# EAGLE board CFT-PB0 (EAGLE 5.11)
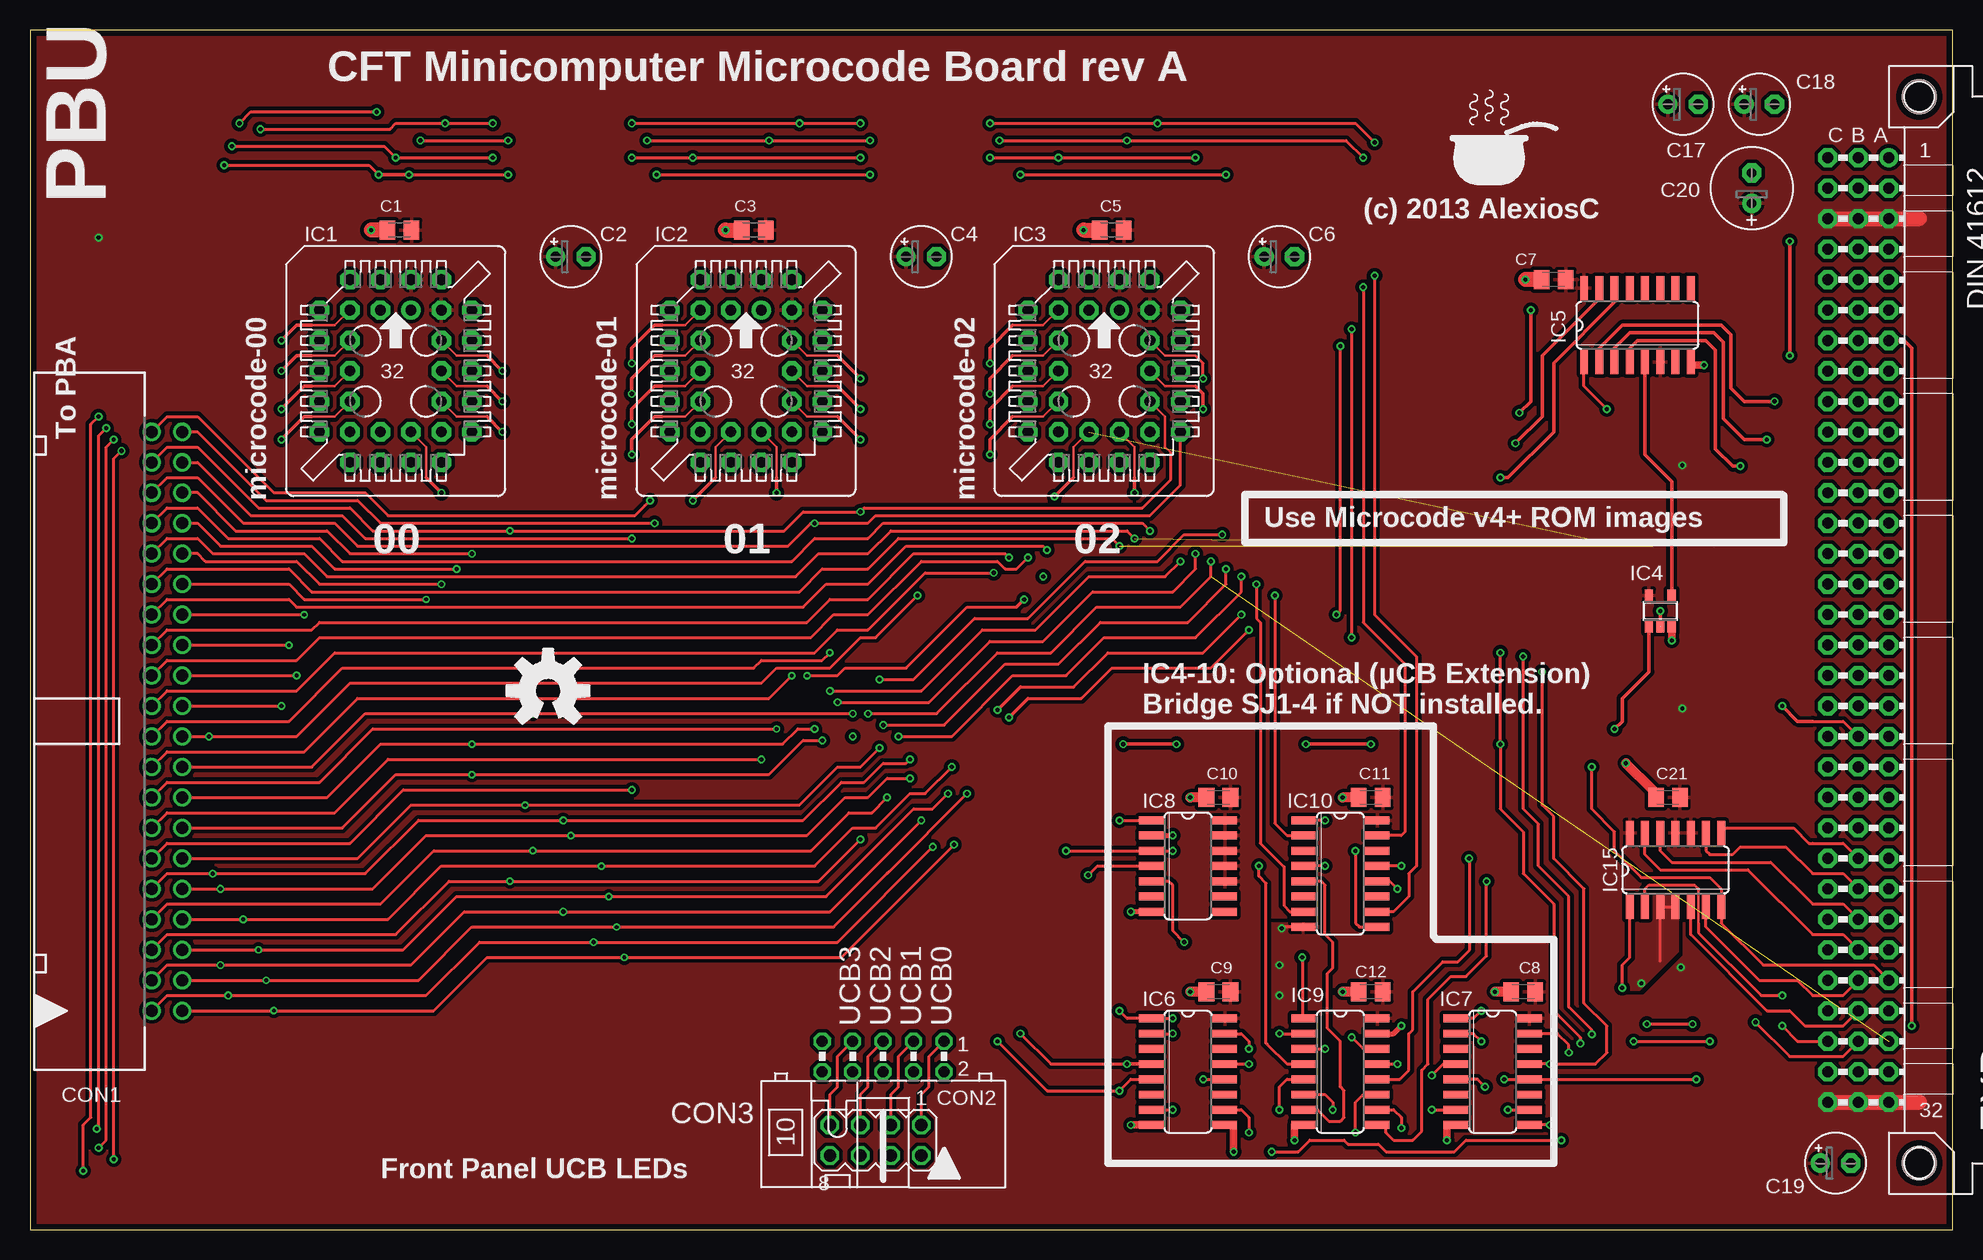
[diagram p4: board, top side]
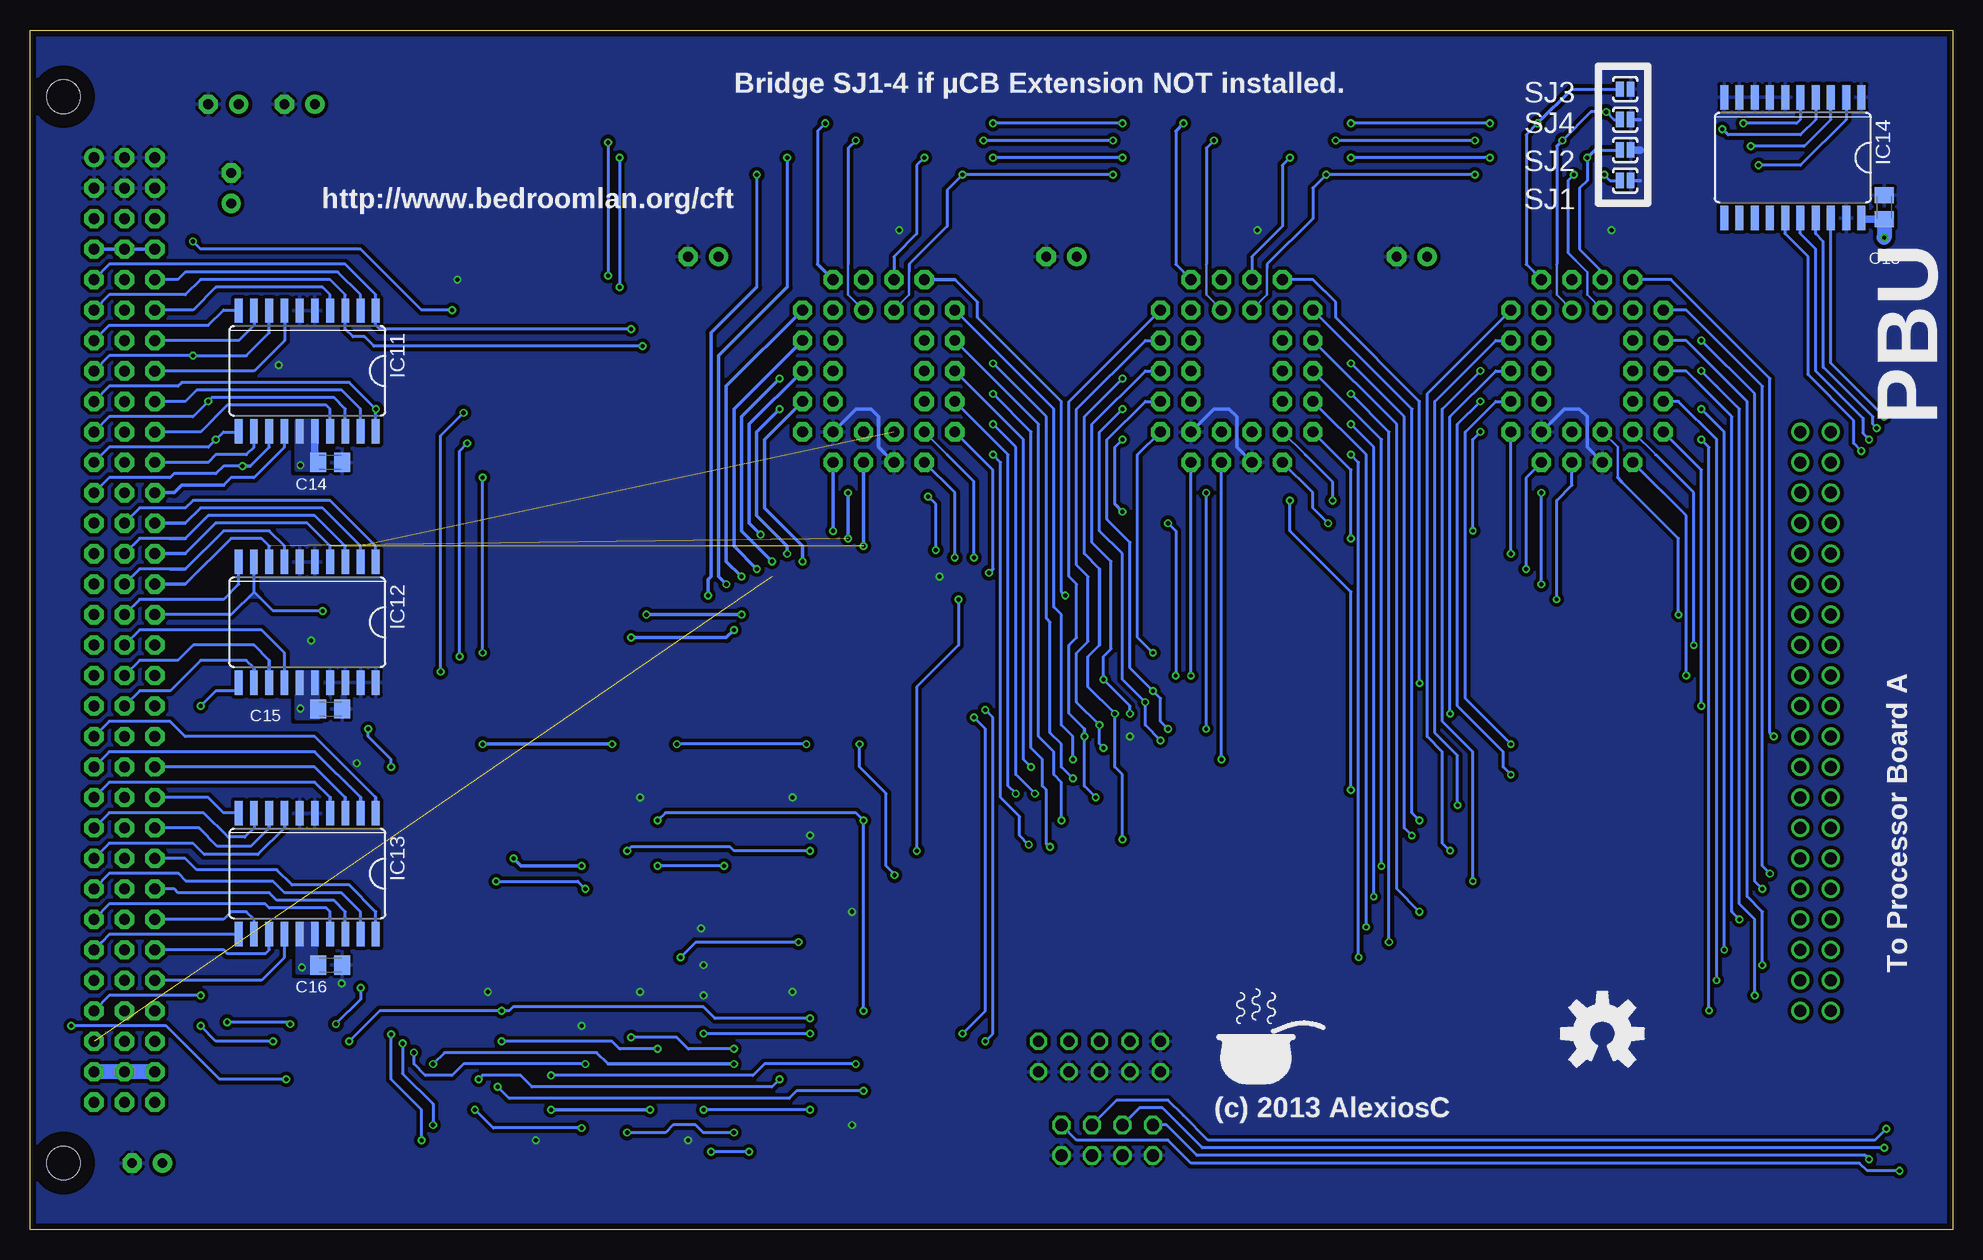
[diagram p5: board, bottom side, seen from below]

Size 160.27 x 100.03 mm. Coordinates in mm from the lower left corner, seen from the top.
Copper layers (1*16): Top 0.035mm / dielectric 1.5mm / Bottom 0.035mm
Design rules "smart-prototyping": minimum track width 7mil, minimum drill 12mil, track to track 7mil, track to pad 7mil, pad to pad 7mil, via to via 7mil, smd to smd 0mil, copper to edge 20mil, drill to drill 10mil, minimum pad ring 10mil, minimum via ring 6mil, stop-mask expansion 2mil, vias tented up to drill 25mil, thermal gap 10mil
Net classes: 0 default: width 0.203 mm, clearance 0.203 mm; 1 low power: width 0.203 mm, clearance 0.254 mm; 2 LED power: width 1.93 mm, clearance 0.254 mm

## Footprints (pad centres in the part's own frame; a part is rotated, then mirrored left to right if it is on the bottom)
C0805K = smd 1.3 x 1.6: 1 -1,0; 2 1,0
E2,5-5 = drill 0.813 pad 1.6 round: + -1.27,0 | drill 0.813 pad 1.6 octagon: - 1.27,0
E2,5-7 = drill 0.813 pad 1.6 round: + -1.27,0 | drill 0.813 pad 1.6 octagon: - 1.27,0
PAK100/2500-5-40 = drill 1 pad 1.422 round: 1 -24.13,-1.27; 2 -24.13,1.27; 3 -21.59,-1.27; 4 -21.59,1.27; 5 -19.05,-1.27; 6 -19.05,1.27; 7 -16.51,-1.27; 8 -16.51,1.27; 9 -13.97,-1.27; 10 -13.97,1.27; 11 -11.43,-1.27; 12 -11.43,1.27; 13 -8.89,-1.27; 14 -8.89,1.27; 15 -6.35,-1.27; 16 -6.35,1.27; 17 -3.81,-1.27; 18 -3.81,1.27; 19 -1.27,-1.27; 20 -1.27,1.27; 21 1.27,-1.27; 22 1.27,1.27; 23 3.81,-1.27; 24 3.81,1.27; 25 6.35,-1.27; 26 6.35,1.27; 27 8.89,-1.27; 28 8.89,1.27; 29 11.43,-1.27; 30 11.43,1.27; 31 13.97,-1.27; 32 13.97,1.27; 33 16.51,-1.27; 34 16.51,1.27; 35 19.05,-1.27; 36 19.05,1.27; 37 21.59,-1.27; 38 21.59,1.27; 39 24.13,-1.27; 40 24.13,1.27
MA04-2 = drill 1.016 octagon: 1 -3.81,-1.27; 2 -3.81,1.27; 3 -1.27,-1.27; 4 -1.27,1.27; 5 1.27,-1.27; 6 1.27,1.27; 7 3.81,-1.27; 8 3.81,1.27
ML10L = drill 0.914 octagon: 1 -5.08,-1.27; 2 -5.08,1.27; 3 -2.54,-1.27; 4 -2.54,1.27; 5 0,-1.27; 6 0,1.27; 7 2.54,-1.27; 8 2.54,1.27; 9 5.08,-1.27; 10 5.08,1.27
VG96K = drill 0.914 pad 1.6 round: A1 154.94,39.37 | drill 0.914 pad 1.6 octagon: A2 154.94,36.83; A3 154.94,34.29; A4 154.94,31.75; A5 154.94,29.21; A6 154.94,26.67; A7 154.94,24.13; A8 154.94,21.59; A9 154.94,19.05; A10 154.94,16.51; A11 154.94,13.97; A12 154.94,11.43; A13 154.94,8.89; A14 154.94,6.35; A15 154.94,3.81; A16 154.94,1.27; A17 154.94,-1.27; A18 154.94,-3.81; A19 154.94,-6.35; A20 154.94,-8.89; A21 154.94,-11.43; A22 154.94,-13.97; A23 154.94,-16.51; A24 154.94,-19.05; A25 154.94,-21.59; A26 154.94,-24.13; A27 154.94,-26.67; A28 154.94,-29.21; A29 154.94,-31.75; A30 154.94,-34.29; A31 154.94,-36.83; A32 154.94,-39.37; B1 152.4,39.37; B2 152.4,36.83; B3 152.4,34.29; B4 152.4,31.75; B5 152.4,29.21; B6 152.4,26.67; B7 152.4,24.13; B8 152.4,21.59; B9 152.4,19.05; B10 152.4,16.51; B11 152.4,13.97; B12 152.4,11.43; B13 152.4,8.89; B14 152.4,6.35; B15 152.4,3.81; B16 152.4,1.27; B17 152.4,-1.27; B18 152.4,-3.81; B19 152.4,-6.35; B20 152.4,-8.89; B21 152.4,-11.43; B22 152.4,-13.97; B23 152.4,-16.51; B24 152.4,-19.05; B25 152.4,-21.59; B26 152.4,-24.13; B27 152.4,-26.67; B28 152.4,-29.21; B29 152.4,-31.75; B30 152.4,-34.29; B31 152.4,-36.83; B32 152.4,-39.37; C1 149.86,39.37; C2 149.86,36.83; C3 149.86,34.29; C4 149.86,31.75; C5 149.86,29.21; C6 149.86,26.67; C7 149.86,24.13; C8 149.86,21.59; C9 149.86,19.05; C10 149.86,16.51; C11 149.86,13.97; C12 149.86,11.43; C13 149.86,8.89; C14 149.86,6.35; C15 149.86,3.81; C16 149.86,1.27; C17 149.86,-1.27; C18 149.86,-3.81; C19 149.86,-6.35; C20 149.86,-8.89; C21 149.86,-11.43; C22 149.86,-13.97; C23 149.86,-16.51; C24 149.86,-19.05; C25 149.86,-21.59; C26 149.86,-24.13; C27 149.86,-26.67; C28 149.86,-29.21; C29 149.86,-31.75; C30 149.86,-34.29; C31 149.86,-36.83; C32 149.86,-39.37 | hole 2.794: 157.48,44.45; 157.48,-44.45
PLCC32 = drill 0.9 pad 1.6 round: 1 1.27,5.08 | drill 0.9 pad 1.6 octagon: 2 -1.27,7.62; 3 -1.27,5.08; 4 -3.81,7.62; 5 -6.35,5.08; 6 -3.81,5.08; 7 -6.35,2.54; 8 -3.81,2.54; 9 -6.35,0; 10 -3.81,0; 11 -6.35,-2.54; 12 -3.81,-2.54; 13 -6.35,-5.08; 14 -3.81,-7.62; 15 -3.81,-5.08; 16 -1.27,-7.62; 17 -1.27,-5.08; 18 1.27,-7.62; 19 1.27,-5.08; 20 3.81,-7.62; 21 6.35,-5.08; 22 3.81,-5.08; 23 6.35,-2.54; 24 3.81,-2.54; 25 6.35,0; 26 3.81,0; 27 6.35,2.54; 28 3.81,2.54; 29 6.35,5.08; 30 3.81,7.62; 31 3.81,5.08; 32 1.27,7.62
SOT23-5 = smd 0.69 x 0.99: 1 -0.95,-1.29; 2 0,-1.29; 3 0.95,-1.29; 4 0.95,1.3; 5 -0.95,1.3
SO16 = smd 0.66 x 2.032: 1 -4.445,-3.073; 2 -3.175,-3.073; 3 -1.905,-3.073; 4 -0.635,-3.073; 5 0.635,-3.073; 6 1.905,-3.073; 7 3.175,-3.073; 8 4.445,-3.073; 9 4.445,3.073; 10 3.175,3.073; 11 1.905,3.073; 12 0.635,3.073; 13 -0.635,3.073; 14 -1.905,3.073; 15 -3.175,3.073; 16 -4.445,3.073
SO14 = smd 0.66 x 2.032: 1 -3.81,-3.073; 2 -2.54,-3.073; 3 -1.27,-3.073; 4 0,-3.073; 5 1.27,-3.073; 6 2.54,-3.073; 7 3.81,-3.073; 8 3.81,3.073; 9 2.54,3.073; 10 1.27,3.073; 11 0,3.073; 12 -1.27,3.073; 13 -2.54,3.073; 14 -3.81,3.073
SO20W = smd 0.66 x 2.032: 1 -5.715,-5.029; 2 -4.445,-5.029; 3 -3.175,-5.029; 4 -1.905,-5.029; 5 -0.635,-5.029; 6 0.635,-5.029; 7 1.905,-5.029; 8 3.175,-5.029; 9 4.445,-5.029; 10 5.715,-5.029; 11 5.715,5.029; 12 4.445,5.029; 13 3.175,5.029; 14 1.905,5.029; 15 0.635,5.029; 16 -0.635,5.029; 17 -1.905,5.029; 18 -3.175,5.029; 19 -4.445,5.029; 20 -5.715,5.029
SJ_2S-NO = smd 0.635 x 1.27: 1 -0.45,0; 2 0.45,0

## Placement (x,y rotation side)
$4_37_$  SIGNATURESILK  [SIGNATURE]  60.96,11.91 0 bottom
$4_39_$  OSHW-LOGOL  [OSHW-LOGO-L]  29.21,16.36 0 bottom
$4_40_$  QRCODE-CFT  [CFT-QRCODE]  -22.86,1.12 0 top  (outside the outline)
C1  0.1uF  [C0805K]  30.8,83.35 180 top
C2  1uF  [E2,5-5]  45.09,81.13 0 top
C3  0.1uF  [C0805K]  60.33,83.35 180 top
C4  1uF  [E2,5-5]  74.3,81.13 0 top
C5  0.1uF  [C0805K]  90.17,83.35 180 top
C6  1uF  [E2,5-5]  104.14,81.13 0 top
C7  0.1uF  [C0805K]  127,79.22 180 top
C8  0.1uF  [C0805K]  124.46,19.85 180 top
C9  0.1uF  [C0805K]  99.06,19.85 180 top
C10  0.1uF  [C0805K]  99.06,36.04 180 top
C11  0.1uF  [C0805K]  111.76,36.04 180 top
C12  0.1uF  [C0805K]  111.76,19.85 180 top
C13  0.1uF  [C0805K]  5.71,85.26 90 bottom
C14  0.1uF  [C0805K]  135.25,63.98 0 bottom
C15  0.1uF  [C0805K]  135.25,43.41 0 bottom
C16  0.1uF  [C0805K]  135.25,22.07 0 bottom
C17  1uF  [E2,5-5]  137.79,93.83 0 top
C18  47uF  [E2,5-5]  144.15,93.83 0 top
C19  47uF  [E2,5-5]  150.5,5.56 0 top
C20  100uF  [E2,5-7]  143.51,86.84 90 top
C21  0.1uF  [C0805K]  136.53,36.04 180 top
CON1  2540-5  [PAK100/2500-5-40]  11.43,42.39 90 top
CON2  [MA04-2]  70.48,7.47 180 top
CON3  [ML10L]  71.12,14.45 180 top
EXP  [VG96K]  0,50.01 0 top
IC1  29F040  [PLCC32]  30.48,71.6 0 top
IC2  29F040  [PLCC32]  59.69,71.6 0 top
IC3  29F040  [PLCC32]  89.53,71.6 0 top
IC4  74AHC1G32DBV  [SOT23-5]  135.89,51.6 0 top
IC5  74HC138D  [SO16]  133.99,75.41 0 top
IC6  74HC175D  [SO16]  96.52,13.18 270 top
IC7  74HC175D  [SO16]  121.92,13.18 270 top
IC8  74HC74D  [SO14]  96.52,30.33 270 top
IC9  74HC157D  [SO16]  109.22,13.18 270 top
IC10  74HC175D  [SO16]  109.22,29.69 270 top
IC11  SN74ACT1073  [SO20W]  137.16,71.6 180 bottom
IC12  SN74ACT1073  [SO20W]  137.16,50.65 180 bottom
IC13  SN74ACT1073  [SO20W]  137.16,29.69 180 bottom
IC14  74HC541DW  [SO20W]  13.34,89.38 180 bottom
IC15  SN74ACT1071D  [SO14]  137.16,30.01 0 top
SJ1  SOLDERJUMPER-OLDNO  [SJ_2S-NO]  27.3,87.48 180 bottom
SJ2  SOLDERJUMPER-OLDNO  [SJ_2S-NO]  27.3,90.02 180 bottom
SJ3  SOLDERJUMPER-OLDNO  [SJ_2S-NO]  27.3,95.1 180 bottom
SJ4  SOLDERJUMPER-OLDNO  [SJ_2S-NO]  27.3,92.56 180 bottom
U$1  SIGNATURESILK  [SIGNATURE]  118.75,86.84 0 top
U$3  OSHW-LOGOL  [OSHW-LOGO-L]  43.18,44.93 0 top
X1  2540-5  [PAK100/2500-5-40]  5.08,-68.73 0 top  (outside the outline)

## Tracks (layer width: path | path; a pad name or v marks a point on that pad's centre or on a via)
!AINDEX  (via drill 0.35)
  Top 0.203: 23.5,72.87 25.4,72.87 IC1.8 | 52.7,72.87 54.61,72.87 IC2.8 | 81.92,72.87 84.45,72.87 IC3.8
  Top 0.254: CON1.2 11.43,19.53 v16.51,19.53 33.02,19.53 37.47,23.98 v46.99,23.98 67.31,23.98 v75.25,31.92
  Top 0.305: v20.95,71.6 22.23,72.87 23.5,72.87 | v50.16,69.7 50.16,70.97 52.07,72.87 52.7,72.87 | v80.01,69.7 80.01,70.97 81.92,72.87
  Bottom 0.254: v50.16,69.7 46.99,66.52 v46.99,23.98 | v16.51,19.53 16.51,25.88 17.78,27.15 17.78,68.43 v20.95,71.6 | v80.01,69.7 76.83,66.52 76.83,40.17 75.88,39.22 75.88,37 75.56,36.68 75.56,32.17 75.25,31.85 v75.25,31.92
!CLI  (via drill 0.3)
  Top 0.254: CON1.18 11.43,39.85 22.86,39.85 27.3,44.3 61.59,44.3 v63.5,46.2
  Bottom 0.254: v63.5,46.2 IC2.20
!CLL  (via drill 0.35)
  Top 0.254: CON1.14 11.43,34.77 25.4,34.77 29.84,39.22 v60.96,39.22
  Bottom 0.254: v60.96,39.22 IC2.18
!CPL  (via drill 0.35)
  Top 0.203: 57.15,62.71 57.15,65.25 IC2.17
  Top 0.254: CON1.12 11.43,32.23 26.67,32.23 31.11,36.68 v50.16,36.68
  Top 0.305: v55.24,60.81 57.15,62.71
  Bottom 0.254: v55.24,60.81 55.24,58.27 50.16,53.19 v50.16,36.68
!DEC  (via drill 0.35)
  Top 0.254: v81.6,56.04 81.28,56.36 73.66,56.36 69.85,52.55 66.67,52.55 64.77,50.65 24.13,50.65 23.5,50.01 11.43,50.01 CON1.26
  Bottom 0.203: 83.82,64.62 IC3.15
  Bottom 0.254: v81.6,56.04 81.6,62.4 83.82,64.62
!END  (via drill 0.3, 0.35)
  Top 0.254: IC3.21 95.89,62.08 93.34,59.54 70.48,59.54 69.85,58.9 v65.41,58.9 65.09,58.9 63.18,57 27.3,57 25.4,58.9 17.78,58.9 13.97,62.71 11.43,62.71 CON1.36 | 82.23,51.92 78.11,51.92 73.03,46.84 67.94,46.84 67.31,46.2 v64.77,46.2 | v95.25,31.6 IC8.3 v86.36,31.6 | IC10.9 110.81,25.25 110.49,25.56 v110.49,31.6
  Top 0.305: 82.23,51.92 v82.87,52.55
  Bottom 0.254: v65.41,58.9 64.77,58.27 v64.77,46.2 | v82.87,52.55 82.87,48.74 86.36,45.25 v86.36,31.6 | v95.25,31.6 101.6,31.6 101.92,31.92 110.17,31.92 v110.49,31.6
!INCPC  (via drill 0.3)
  Top 0.254: CON1.20 11.43,42.39 21.59,42.39 26.04,46.84 60.33,46.84 60.96,47.47 66.04,47.47 v66.67,48.11
  Bottom 0.254: IC2.21 67.94,64.62 67.94,49.38 v66.67,48.11
!IO  (via drill 0.35)  (1 unrouted)
  Top 0.254: v90.81,57 90.17,57.63 72.39,57.63 69.85,55.09 66.04,55.09 64.14,53.19 23.5,53.19 21.59,55.09 11.43,55.09 CON1.30
  Bottom 0.254: 147.32,56.36 144.78,58.9 137.16,58.9 135.25,57 IC12.4
  Bottom 0.305: v90.81,57 IC3.18 | 147.32,56.36 EXP.C14
!IODEV1XX
  Top 0.254: EXP.B24 151.13,32.23 148.59,32.23 148.27,32.23 147,33.5 141.39,33.5 IC15.8
!IODEV2XX
  Top 0.254: EXP.B25 151.13,29.69 148.59,29.69 146.37,31.92 142.56,31.92 141.92,31.28 140.02,31.28 139.7,31.6 IC15.9
!IODEV3XX
  Top 0.254: EXP.B26 151.13,27.15 148.59,27.15 145.1,30.65 136.84,30.65 135.89,31.6 IC15.12
!IRQS  (via drill 0.3, 0.35)  (1 unrouted)
  Top 0.203: 38.1,72.87 35.56,72.87 IC1.28 | 67.31,72.87 64.77,72.87 IC2.28 | 97.16,72.87 94.61,72.87 IC3.28
  Top 0.254: v98.42,55.73 98.42,54.46 95.89,51.92 88.9,51.92 85.09,48.11 80.64,48.11 75.56,43.03 v69.85,43.03 | 97.16,72.87 97.79,72.24 v97.79,70.97 | CON1.6 11.43,24.61 30.48,24.61 34.92,29.06 v40.01,29.06 65.72,29.06 v69.22,32.55
  Top 0.305: v39.37,71.6 38.1,72.87 | v69.22,70.97 67.31,72.87
  Bottom 0.254: 71.12,48.74 72.07,47.79 72.07,45.25 v69.85,43.03 69.85,38.58 69.22,37.95 v69.22,32.55 | 71.12,55.09 72.39,56.36 72.39,67.79 v69.22,70.97 | v39.37,71.6 42.55,68.43 42.55,42.39 40.01,39.85 v40.01,29.06
  Bottom 0.305: 71.12,48.74 71.12,55.09 | v97.79,70.97 100.97,67.79 100.97,58.27 v98.42,55.73
!MEM  (via drill 0.35)  (1 unrouted)
  Top 0.203: 87,62.71 87,65.25 IC3.17
  Top 0.254: v84.77,56.68 84.45,57 73.03,57 69.85,53.82 66.36,53.82 64.45,51.92 22.23,51.92 21.59,52.55 11.43,52.55 CON1.28
  Top 0.305: v85.41,61.12 87,62.71
  Bottom 0.254: v84.77,56.68 84.77,60.49 v85.41,61.12 | 147.32,58.9 146.05,60.17 135.89,60.17 132.72,57 IC12.2
  Bottom 0.305: 147.32,58.9 EXP.C13
!R  (via drill 0.35)  (1 unrouted)
  Top 0.203: 92.08,62.71 92.08,65.25 IC3.19
  Top 0.254: v92.08,57.63 91.44,58.27 71.75,58.27 69.85,56.36 65.72,56.36 63.82,54.46 24.77,54.46 22.86,56.36 15.24,56.36 13.97,57.63 11.43,57.63 CON1.32
  Top 0.305: v92.08,61.44 92.08,62.71
  Bottom 0.254: 147.32,53.82 143.51,57.63 140.97,57.63 140.34,57 IC12.8
  Bottom 0.305: v92.08,57.63 v92.08,61.44 | 147.32,53.82 EXP.C15
!RESET  (via drill 0.35)
  Top 0.254: v95.25,17.63 IC6.1 91.44,17.63 v90.81,18.26 | v120.97,18.26 120.33,17.63 IC7.1 | v90.81,34.14 IC8.1 | v107.95,34.14 IC10.1 | v146.05,16.99 147.32,15.72 EXP.C30 | v133.67,15.72 v140.02,15.72
  Bottom 0.254: v95.25,17.63 103.19,17.63 104.14,18.58 120.02,18.58 120.33,18.26 v120.97,18.26 131.13,18.26 v133.67,15.72 | v107.95,34.14 107.31,34.77 91.44,34.77 v90.81,34.14 v90.81,18.26 | v140.02,15.72 144.78,15.72 v146.05,16.99
!RSTHOLD  (via drill 0.3, 0.35)
  Top 0.254: v100.97,54.46 100.97,53.19 97.16,49.38 89.53,49.38 86.36,46.2 81.92,46.2 76.83,41.12 v72.39,41.12 | v71.44,36.04 70.17,34.77 68.26,34.77 65.09,31.6 v41.91,31.6 33.66,31.6 29.21,27.15 11.43,27.15 CON1.8
  Bottom 0.254: v71.44,36.04 72.39,37 v72.39,41.12 | 72.39,41.76 73.66,43.03 73.66,48.74 73.03,49.38 73.03,53.82 73.66,54.46 73.66,69.06 IC2.29 | IC1.29 43.81,69.7 43.81,41.12 42.55,39.85 42.55,32.23 v41.91,31.6
  Bottom 0.305: IC3.29 102.23,70.33 102.23,55.73 v100.97,54.46 | v72.39,41.12 72.39,41.76
!SETUCBP  (via drill 0.35)
  Top 0.254: 100.33,8.74 IC6.9 | v124.46,47.79 124.46,35.09 125.73,33.82 125.73,30.33 128.27,27.79 128.27,18.58 130.18,16.67 v130.18,16.29 | v103.5,6.51 105.73,6.51 106.68,7.47 109.54,7.47 109.86,7.15 112.39,7.15 113.03,6.51 118.75,6.51 119.7,7.47 v127.64,7.47
  Top 0.305: v123.83,65.57 126.05,67.79 126.05,72.87 130.81,77.64 IC5.15
  Top 0.61: v100.33,6.51 100.33,8.74
  Bottom 0.254: v124.46,47.79 124.46,64.94 v123.83,65.57 | v127.64,7.47 127.64,10.01 130.18,12.55 v130.18,16.29 | v100.33,6.51 v103.5,6.51
!SETUCBT  (via drill 0.35)
  Top 0.254: v126.68,8.74 IC7.9 | v122.56,48.11 v122.56,40.49 122.56,35.09 124.46,33.19 124.46,29.69 127,27.15 127,18.26 129.22,16.04 v129.22,15.53 | IC8.4 88.96,30.33 v88.2,29.57
  Top 0.305: v122.56,62.71 123.19,62.71 127,66.52 127,72.24 132.08,77.32 IC5.14 | v91.12,40.49 v95.57,40.49 | v106.36,40.49 v111.76,40.49
  Bottom 0.254: v129.22,15.53 129.22,13.02 126.68,10.48 v126.68,8.74 | v122.56,48.11 v122.56,62.71 | v88.2,29.57 88.2,29.63 88.9,30.33 88.9,36.36 91.12,38.58 v91.12,40.49 | v95.57,40.49 v106.36,40.49
  Bottom 0.305: v111.76,40.49 v122.56,40.49
!SKIP  (via drill 0.35)
  Top 0.254: CON1.4 11.43,22.07 v15.88,22.07 31.75,22.07 36.2,26.52 v44.45,26.52 66.67,26.52 v74.3,34.14
  Bottom 0.254: v15.88,22.07 15.88,26.52 17.14,27.79 17.14,69.06 22.23,74.14 IC1.7 | IC2.7 46.35,67.16 46.35,28.42 v44.45,26.52 | IC3.7 76.2,67.16 76.2,41.12 74.93,39.85 74.93,37.95 74.3,37.31 v74.3,34.14
!STI  (via drill 0.3, 0.35)
  Top 0.203: 62.23,62.71 62.23,65.25 IC2.19
  Top 0.254: CON1.16 11.43,37.31 24.13,37.31 28.57,41.76 v62.23,41.76
  Top 0.305: v62.23,61.44 62.23,62.71
  Bottom 0.254: v62.23,41.76 v62.23,61.44
!STPAC  (via drill 0.35)
  Top 0.254: v83.19,56.04 82.23,55.09 81.28,55.09 80.64,55.73 74.3,55.73 69.85,51.28 66.99,51.28 65.09,49.38 24.13,49.38 22.23,47.47 11.43,47.47 CON1.24
  Bottom 0.254: IC3.14 83.19,61.44 v83.19,56.04
!STPDR  (via drill 0.35)
  Top 0.254: v80.33,54.77 74.61,54.77 69.85,50.01 67.31,50.01 65.41,48.11 25.4,48.11 22.23,44.93 11.43,44.93 CON1.22
  Bottom 0.254: IC3.13 80.01,63.35 80.01,55.09
  Bottom 0.305: v80.33,54.77 80.01,55.09
!SYSDEV  (via drill 0.35)
  Top 0.254: EXP.A28 153.67,22.07 144.46,22.07 140.97,25.56 IC15.7 140.97,28.42 140.02,29.37 134.3,29.37 132.08,31.6 132.08,33.19 130.18,35.09 v130.18,38.58
  Top 0.305: v132.08,41.76 132.72,42.39 132.72,44.3 134.94,46.52 IC4.1
  Bottom 0.254: v130.18,38.58 130.18,39.22 132.08,41.12 v132.08,41.76
!T34
  Top 0.254: EXP.B27 151.13,24.61 148.59,24.61 143.19,30.01 135.89,30.01 134.62,31.28 IC15.13
!UCBA!/UCBB  (via drill 0.35)
  Top 0.254: IC9.1 106.05,17.73 v106.05,22.71 | v96.2,23.98 95.25,24.93 95.25,28.74 94.93,29.06 IC8.5
  Bottom 0.254: v96.2,23.98 104.78,23.98 v106.05,22.71
!UCE  (via drill 0.3, 0.35)
  Top 0.203: 67.31,67.79 64.77,67.79 IC2.24 | 95.09,64.78 94.61,65.25 94.61,67.79 IC3.24 | 38.1,67.79 35.56,67.79 IC1.24
  Top 0.254: 95.09,64.78 95.09,62.55 92.71,60.17 69.53,60.17 v69.22,59.86 64.45,59.86 62.87,58.27 v40.01,58.27 28.57,58.27 26.67,60.17 19.05,60.17 13.97,65.25 11.43,65.25 CON1.38 | 95.09,64.78
  Top 0.305: v69.22,65.89 67.31,67.79 | v39.37,66.52 38.1,67.79
  Bottom 0.254: v69.22,65.89 69.85,65.25 69.85,60.49 | v39.37,66.52 40.01,65.89 v40.01,58.27
  Bottom 0.305: v69.22,59.86 69.85,60.49
!W  (via drill 0.35)
  Top 0.305: IC4.2 v135.89,51.6
  Bottom 0.254: EXP.C16 143.51,51.28 141.6,53.19 | 141.6,53.19 IC12.9 | v135.89,51.6 140.02,51.6 141.6,53.19
  pour Bottom: 141.6,53.19 141.13,52.71 142.08,52.71
!WEN  (via drill 0.35)
  Top 0.254: v93.34,58.27 92.71,58.9 71.12,58.9 69.85,57.63 65.41,57.63 63.5,55.73 26.04,55.73 24.13,57.63 16.51,57.63 13.97,60.17 11.43,60.17 CON1.34
  Bottom 0.305: v93.34,58.27 IC3.20
+3.3V
  Bottom 0.305: EXP.C4 EXP.B4 EXP.A4
+12V
  Bottom 1.27: EXP.C31 EXP.B31 EXP.A31
AB0  (via drill 0.35)
  Top 0.254: v91.44,13.82 IC6.4 85.09,13.82 v82.55,16.36 | IC7.4 117.79,13.82 v116.84,12.87 | v110.17,49.38 v110.17,75.09 | v101.6,50.01 98.42,46.84 90.17,46.84 87.63,44.3 83.19,44.3
  Top 0.305: v81.6,42.71 83.19,44.3
  Bottom 0.254: EXP.A5 153.67,80.49 133.99,80.49 131.44,77.95 IC11.1 131.44,75.41 131.13,75.09 v110.17,75.09 | v91.44,13.82 99.06,13.82 100.01,12.87 v116.84,12.87 | v82.55,16.36 80.64,18.26 80.64,41.76 v81.6,42.71
  Bottom 0.305: v101.6,50.01 102.23,49.38 v110.17,49.38
AB1  (via drill 0.35)
  Top 0.254: v109.22,73.67 109.22,51.6 v108.9,51.28 | IC7.5 120.65,12.55 v121.28,11.91 | v100.97,51.28 97.79,48.11 89.85,48.11 87,45.25 82.55,45.25 | IC6.5 91.76,12.55 v90.81,11.6 84.77,11.6 v80.64,15.72
  Top 0.305: v80.64,43.34 82.55,45.25
  Bottom 0.254: EXP.A6 153.67,77.95 147.32,77.95 146.05,79.22 135.25,79.22 133.99,77.95 IC11.3 133.99,75.09 133.35,74.46 132.4,74.46 131.6,73.67 v109.22,73.67 | v121.28,11.91 120.33,10.96 97,10.96 96.36,11.6 v90.81,11.6 | v80.64,15.72 80.01,16.36 80.01,42.71 v80.64,43.34
  Bottom 0.305: v100.97,51.28 v108.9,51.28
AB2  (via drill 0.35)
  Top 0.254: v97.79,12.55 IC6.12 | v122.87,12.55 IC7.12 v138.91,12.55 | v138.91,12.55
  Top 0.305: EXP.A7 156.21,74.14 156.84,73.51 v156.84,16.99
  Bottom 0.254: 142.93,76.68 144.15,76.68 145.41,75.41 153.67,75.41 EXP.A7 | v97.79,12.55 98.42,11.91 118.43,11.91 119.38,12.87 122.56,12.87 | v156.84,16.99 148.91,16.99 144.46,12.55 v138.91,12.55
  Bottom 0.305: 142.93,76.68 IC11.10 | 122.56,12.87 v122.87,12.55
AB3  (via drill 0.35)
  Top 0.254: IC7.13 v126.68,13.82 130.49,13.82 131.44,14.77 131.44,16.99 129.54,18.9 129.54,28.42 127,30.96 127,34.45 126.05,35.41 v126.05,46.52 | IC6.13 v101.6,13.82
  Top 0.305: v146.69,82.4 v146.69,72.87 | v124.14,68.11 125.09,69.06 v125.09,76.68
  Bottom 0.254: EXP.A8 153.67,72.87 v146.69,72.87 142.24,72.87 140.34,74.78 IC11.8 | v146.69,82.4 146.05,81.76 132.72,81.76 127.64,76.68 v125.09,76.68 | 112.08,13.82 113.03,14.77 125.73,14.77 v126.68,13.82 | v124.14,68.11 126.05,66.2 v126.05,46.52
  Bottom 0.305: v101.6,13.82 112.08,13.82
AB4  (via drill 0.35)
  Top 0.254: IC5.1 129.54,70.33 v131.44,68.43
  Bottom 0.254: EXP.A9 153.67,70.33 147.96,70.33 147.64,70.65 133.67,70.65 v131.44,68.43 IC11.20
AB5  (via drill 0.35)
  Top 0.305: v145.41,69.06 142.88,69.06 141.76,70.17 141.76,74.62 140.97,75.41 132.72,75.41 130.81,73.51 IC5.2
  Bottom 0.254: EXP.A10 153.67,67.79 146.69,67.79 v145.41,69.06 145.1,69.38 134.94,69.38 133.99,68.43 IC11.18
AB6  (via drill 0.35)
  Top 0.305: v144.78,65.89 142.88,65.89 141.13,67.63 141.13,73.98 140.34,74.78 133.35,74.78 132.08,73.51 IC5.3
  Bottom 0.203: 154.31,64.62 EXP.A11
  Bottom 0.254: 154.31,64.62 153.67,65.25 145.41,65.25 v144.78,65.89 144.15,66.52 142.93,66.52
  Bottom 0.305: 142.93,66.52 IC11.11
AB7  (via drill 0.35)
  Top 0.305: v142.56,63.66 141.92,63.66 140.49,65.09 140.49,73.35 139.7,74.14 133.99,74.14 133.35,73.51 IC5.4
  Bottom 0.254: 141.92,63.66 140.34,65.25 IC11.13 | v142.56,63.66 144.15,63.66 144.78,63.03 148.27,63.03 148.59,62.71 153.67,62.71 EXP.A12
  Bottom 0.305: v142.56,63.66 141.92,63.66
AB8
  Bottom 0.254: EXP.A20 153.67,42.39 148.91,42.39 148.59,42.39 147.32,41.12 136.53,41.12 131.44,36.04
  Bottom 0.305: IC13.1 131.44,36.04
AB9
  Bottom 0.254: EXP.A21 153.67,39.85 148.59,39.85 136.53,39.85 132.72,36.04
  Bottom 0.305: IC13.2 132.72,36.04
AB10
  Bottom 0.254: EXP.A22 153.67,37.31 136.53,37.31 135.25,36.04
  Bottom 0.305: IC13.4 135.25,36.04
AB11
  Bottom 0.254: EXP.A23 153.67,34.77 145.8,34.77 143.76,32.74 142.37,32.74 141.6,33.5 IC13.9
AB12
  Bottom 0.254: EXP.A24 153.67,32.23 146.69,32.23 145.73,31.28 141.29,31.28 139.06,33.5
  Bottom 0.305: IC13.7 139.06,33.5
AB13
  Bottom 0.254: IC13.19 132.72,26.52 134.3,28.1 139.06,28.1 140.02,29.06 147.26,29.06 147.89,29.69 153.67,29.69 EXP.A25
AB14
  Bottom 0.254: EXP.A26 153.67,27.15 140.65,27.15 140.34,26.83 135.57,26.83 135.25,26.52 IC13.17
AB15
  Bottom 0.203: 154.31,23.98 EXP.A27
  Bottom 0.254: 154.31,23.98 153.67,24.61 142.93,24.61 IC13.11
AEXT0
  Bottom 0.254: EXP.B13 151.13,60.17 148.59,60.17 147.32,60.17 146.69,60.81 135.25,60.81 131.44,57 IC12.1
AEXT1
  Bottom 0.254: 148.59,57.63 151.13,57.63 EXP.B14 | 147.32,57.63 145.41,59.54 136.53,59.54 133.99,57 IC12.3
  Bottom 0.305: 147.32,57.63 148.59,57.63
AEXT2
  Bottom 0.254: 148.59,55.09 151.13,55.09 EXP.B15 | 147.32,55.09 144.15,58.27 140.34,58.27 139.06,57 IC12.7
  Bottom 0.305: 147.32,55.09 148.59,55.09
AEXT3
  Bottom 0.254: EXP.B16 151.13,52.55 148.59,52.55 144.15,52.55 142.88,53.82 IC12.10
AEXT4
  Bottom 0.254: EXP.B17 151.13,50.01 148.59,50.01 140.97,50.01 139.06,48.11 IC12.14
AEXT5
  Bottom 0.254: EXP.B18 151.13,47.47 147.96,47.47 146.69,48.74 141.6,48.74 140.34,47.47
  Bottom 0.305: IC12.13 140.34,47.47
AEXT6
  Bottom 0.254: EXP.B19 151.13,44.93 148.91,44.93 148.59,44.93 146.05,47.47 142.24,47.47 141.6,46.84
  Bottom 0.305: IC12.12 141.6,46.84
AEXT7  (via drill 0.35)
  Top 0.254: EXP.B20 151.13,42.39 148.59,42.39
  Top 0.305: v146.05,43.66 147.32,42.39 148.59,42.39
  Bottom 0.254: v146.05,43.66 144.78,44.93 142.88,44.93
  Bottom 0.305: IC12.11 142.88,44.93
BUCB0  (via drill 0.35)
  Top 0.254: v5.71,67.79 5.08,67.16 5.08,9.37 4.45,8.74 v4.45,4.93 | CON2.1 74.3,11.28 74.93,11.91 74.93,14.45 CON3.1
  Bottom 0.254: IC14.18 10.16,72.24 v5.71,67.79 | v4.45,4.93 7.14,4.93 7.78,5.56 63.5,5.56 65.41,7.47 73.03,7.47 CON2.1
BUCB1  (via drill 0.35)
  Top 0.203: v5.56,8.42 | v5.56,8.42 5.71,8.58
  Top 0.254: 5.71,8.58 5.71,66.2 v6.35,66.84 | CON2.3 71.75,11.28 72.39,11.91 72.39,14.45 CON3.3
  Bottom 0.254: IC14.17 11.43,83.03 10.79,82.4 10.79,71.92 6.67,67.79 6.67,67.16 v6.35,66.84 | v5.56,8.42 6.51,7.47 62.07,7.47 64.14,9.53 65.41,10.8 69.69,10.8 | 69.69,10.8 | 69.69,10.8 CON2.3
BUCB2  (via drill 0.35)
  Top 0.254: v5.71,6.83 6.35,7.47 6.35,65.25 v6.99,65.89 | CON2.5 69.22,11.28 69.85,11.91 69.85,14.45 CON3.5
  Bottom 0.254: v6.99,65.89 7.46,66.36 7.46,67.63 11.43,71.6 11.43,81.76 12.7,83.03 IC14.16 | CON2.5 67.79,10.17 65.88,10.17 62.55,6.83 v5.71,6.83
BUCB3  (via drill 0.35)
  Top 0.254: v7.62,64.94 6.99,64.3 v6.99,5.88 | CON2.7 66.67,11.28 67.31,11.91 67.31,14.45 CON3.7
  Bottom 0.254: IC14.15 13.97,83.03 12.06,81.13 12.06,71.28 8.26,67.48 8.26,65.57 v7.62,64.94 | v6.99,5.88 7.3,6.2 63.02,6.2 65.56,8.74 CON2.7
CLK1  (via drill 0.35)
  Top 0.203: 139.06,28.26 139.06,25.57
  Top 0.254: IC15.2 134.62,28.42 134.94,28.74 138.75,28.74 139.06,28.42 139.06,28.26 | 139.06,25.57 139.06,24.77 144.3,19.53 v146.05,19.53 145.73,19.53
  Bottom 0.254: v146.05,19.53 153.67,19.53 EXP.A29
CLK2
  Top 0.254: IC15.5 138.43,24.61 144.78,18.26 146.69,18.26 147.96,16.99 151.13,16.99 EXP.B29
CLK3  (via drill 0.35)
  Top 0.254: v132.72,20.17 132.72,22.07 133.35,22.71 IC15.1 | v134.78,17.15 v138.59,17.15 | EXP.B30 151.13,14.45 146.69,14.45 v143.83,17.31
  Bottom 0.254: v132.72,20.17 132.72,19.22 v134.78,17.15 | v143.83,17.31 138.75,17.31 v138.59,17.15
CLK4
  Top 0.254: IC15.6 139.7,25.25 144.15,20.8 147.32,20.8 148.59,19.53 151.13,19.53 EXP.B28
DB0
  Bottom 0.254: EXP.C5 147.96,79.22 147.32,79.86 134.62,79.86 132.72,77.95 IC11.2
DB1
  Bottom 0.254: EXP.C6 146.69,76.68 144.78,78.59 135.89,78.59 135.25,77.95 IC11.4
DB2
  Bottom 0.254: EXP.C7 142.88,74.14 141.6,75.41 IC11.9
DB3
  Bottom 0.254: EXP.C8 141.6,71.6 139.06,74.14 IC11.7
DB4
  Bottom 0.254: EXP.C9 147.32,69.06 146.37,70.01 134.3,70.01 132.72,68.43 IC11.19
DB5
  Bottom 0.254: EXP.C10 146.05,66.52 143.83,68.75 135.57,68.75 135.25,68.43 IC11.17
DB6
  Bottom 0.254: EXP.C11 145.41,63.98 144.78,64.62 142.24,64.62 141.6,65.25 IC11.12
DB7
  Bottom 0.254: 144.15,62.08 143.51,62.71 141.6,62.71 139.06,65.25 IC11.14
  Bottom 0.305: 144.15,62.08 147.64,62.08 148.27,61.44 EXP.C12
DB8
  Bottom 0.254: EXP.C21 136.53,38.58 133.99,36.04
  Bottom 0.305: IC13.3 133.99,36.04
DB9
  Bottom 0.254: EXP.C22 145.41,36.04 144.15,34.77 142.93,34.77 IC13.10
DB10
  Bottom 0.254: EXP.C23 146.18,33.5 144.65,31.98 141.86,31.98 140.34,33.5
  Bottom 0.305: 140.34,33.5 IC13.8
DB11
  Bottom 0.254: EXP.C24 147.32,30.96 146.37,30.01 139.7,30.01 138.43,28.74 133.67,28.74 131.44,26.52 IC13.20
DB12
  Bottom 0.254: EXP.C25 148.27,28.42 147.96,28.1 140.34,28.1 139.7,27.47 134.94,27.47 133.99,26.52 IC13.18
DB13
  Bottom 0.254: EXP.C26 144.15,25.88 143.51,26.52 142.24,26.52 141.6,25.88 IC13.12
DB14
  Bottom 0.254: EXP.C27 144.15,23.34 143.83,23.03 140.65,23.03 140.34,23.34 IC13.13
DB15
  Bottom 0.254: IC13.14 139.06,22.71 140.97,20.8 EXP.C28
FL  (via drill 0.3, 0.35)
  Top 0.254: v99.38,57.95 96.2,57.95 93.98,55.73 87.95,55.73 83.19,50.97 78.74,50.97 73.66,45.89 v70.8,45.89 | CON1.17 23.5,38.58 27.94,43.03 v41.91,43.03 v68.58,43.03
  Bottom 0.254: v68.58,43.03 68.58,43.66 v70.8,45.89 70.8,47.79 70.17,48.43 70.17,55.73 71.75,57.32 71.75,67.16 67.31,71.6 IC2.25 | IC1.25 38.1,71.6 41.91,67.79 v41.91,43.03
  Bottom 0.305: IC3.25 100.33,67.16 100.33,58.9 v99.38,57.95
FV  (via drill 0.3, 0.35)
  Top 0.254: v73.98,52.87 70.48,49.38 69.22,49.38 66.67,46.84 62.23,46.84 60.96,45.57 v44.45,45.57 26.67,45.57 22.23,41.12 v14.92,41.12 CON1.19
  Bottom 0.254: 83.19,79.22 81.28,77.32 81.28,76.05 74.3,69.06 74.3,53.19 v73.98,52.87 | IC2.4 53.34,79.22 51.44,77.32 51.44,76.05 44.45,69.06 v44.45,45.57 | IC1.4 23.5,79.22 15.24,70.97 15.24,41.44 v14.92,41.12
  Bottom 0.305: 83.19,79.22 IC3.4
GND  (via drill 0.35)
  Top 0.254: 105.41,8.74 IC9.8 | 118.11,8.74 IC7.8 | IC10.8 104.39,25.25 104.33,25.18 v104.33,25.12 | 135.89,22.39 IC15.3 IC15.4 | 135.25,36.68 135.53,36.68 C21.2
  Top 0.305: 136.84,49.25 v136.84,49.12
  Top 0.406: IC8.7 v91.76,26.52 | IC8.2 v95.25,32.87 | IC9.15 113.67,16.36 v114.3,16.99
  Top 0.61: v105.41,7.47 105.41,8.74 | v118.11,7.47 118.11,8.74 | IC6.8 v91.76,8.74 | IC4.3 136.84,49.25 | v139.54,72.08 138.43,72.08 IC5.8
  Top 0.813: C10.2 v96.71,36.04 | C11.2 v109.41,36.04 | C8.2 v122.11,19.85 | C9.2 v96.71,19.85 | C12.2 v109.41,19.85 | 135.25,36.68 v133.03,38.9
  Top 1.27: C7.2 v124.65,79.22 | C1.2 v28.45,83.35 | v87.82,83.35 C5.2 | v57.98,83.35 C3.2
  Bottom 0.305: IC1.22 32.38,68.43 31.11,68.43 30.48,67.79 30.48,65.25 IC1.16 | IC2.22 61.59,68.43 60.33,68.43 59.69,67.79 59.69,65.25 IC2.16 | IC3.16 89.53,65.25 89.53,67.79 90.17,68.43 91.44,68.43 IC3.22 | SJ4.1 26.04,92.56 | SJ1.1 26.04,87.48
  Bottom 0.61: SJ2.1 26.04,90.02
  other vias: 134.3,20.55 84.45,54.46 104.14,22.07 104.14,19.53 68.58,41.12
  pour Bottom (isolate 0.305, rank 6): 0,100.05 160.02,100.05 160.02,0.48 0,0.48
  pour Top (isolate 0.305, rank 2): 103.5,25.57 107.95,25.57 107.95,24.3 108.27,23.98 108.27,21.44 107.95,21.12 107.95,17.95 106.68,17.95 105.09,16.36 103.5,16.36
  pour Top (isolate 0.305, no thermals): 133.35,27.79 137.32,27.79 137.32,23.18 134.14,20.01 132.72,20.01 132.72,22.07 133.35,22.71
IR11  (via drill 0.3, 0.35)
  Top 0.203: 23.5,75.41 25.4,75.41 IC1.6 | 52.7,75.41 54.61,75.41 IC2.6 | 81.92,75.41 84.45,75.41 IC3.6
  Top 0.254: v73.34,37.63 71.44,37.63 69.85,36.04 67.94,36.04 64.77,32.87 v45.09,32.87 33.02,32.87 28.57,28.42 v15.88,28.42 CON1.9
  Top 0.305: v20.95,74.14 22.23,75.41 23.5,75.41 | v50.16,72.24 50.16,73.51 52.07,75.41 52.7,75.41 | v80.01,72.24 80.01,73.51 81.92,75.41
  Bottom 0.254: v20.95,74.14 16.51,69.7 16.51,29.06 v15.88,28.42 | v50.16,72.24 45.72,67.79 45.72,33.5 v45.09,32.87 | v80.01,72.24 75.56,67.79 75.56,50.97 75.25,50.65 75.25,41.44 74.3,40.49 74.3,38.58 v73.34,37.63
IR12  (via drill 0.35, 0.35 pad 0.61)
  Top 0.203: 73.03,38.9 v73.34,39.22
  Top 0.254: 73.03,38.9 71.12,38.9 69.53,37.31 67.63,37.31 64.45,34.14 v44.45,34.14 32.38,34.14 27.94,29.69 v15.24,29.69 11.43,29.69 CON1.10
  Bottom 0.254: IC3.5 74.93,68.43 74.93,51.92 74.3,51.28 74.3,42.08 73.34,41.12 v73.34,39.22 | IC2.5 45.09,68.43 45.09,34.77 v44.45,34.14 | IC1.5 22.23,76.68 15.88,70.33 15.88,30.33 v15.24,29.69
IR13  (via drill 0.3, 0.35)
  Top 0.254: v70.8,40.17 69.22,38.58 67.31,38.58 64.14,35.41 v41.27,35.41 31.75,35.41 27.3,30.96 CON1.11 | v71.12,42.08 76.2,42.08 81.28,47.15 85.72,47.15 89.22,50.65 96.52,50.65 99.69,53.82 v99.69,55.09
  Bottom 0.254: v70.8,40.17 71.12,40.49 v71.12,42.08 73.03,43.98 73.03,48.11 72.07,49.06 72.07,54.46 73.03,55.41 73.03,68.43 67.31,74.14 IC2.27 | IC1.27 38.1,74.14 43.18,69.06 43.18,41.44 41.27,39.54 v41.27,35.41
  Bottom 0.305: IC3.27 101.6,68.43 101.6,57 v99.69,55.09
IR14  (via drill 0.3, 0.35)
  Top 0.203: 38.1,70.33 35.56,70.33 IC1.26 | 67.31,70.33 64.77,70.33 IC2.26 | 97.16,70.33 94.61,70.33 IC3.26
  Top 0.254: v66.04,40.8 64.45,40.8 61.59,37.95 v36.83,37.95 30.48,37.95 26.04,33.5 CON1.13 | v97.16,56.36 97.16,55.09 95.25,53.19 88.58,53.19 84.45,49.06 80.01,49.06 74.93,43.98 v67.31,43.98
  Top 0.305: v39.37,69.06 38.1,70.33 | v69.22,68.43 67.31,70.33 | v97.79,68.43 97.79,69.7 97.16,70.33
  Bottom 0.254: v66.04,40.8 67.31,42.08 v67.31,43.98 69.22,45.89 69.22,56.36 71.12,58.27 71.12,66.52 v69.22,68.43 | v39.37,69.06 41.27,67.16 41.27,43.66 37.47,39.85 37.47,38.58 v36.83,37.95
  Bottom 0.305: v97.79,68.43 99.69,66.52 99.69,59.54 97.16,57 v97.16,56.36
IR15  (via drill 0.3, 0.35)
  Top 0.254: v65.41,41.76 64.01,41.76 62.74,40.49 v36.83,40.49 29.21,40.49 24.77,36.04 CON1.15 | v95.89,55.73 94.61,54.46 88.27,54.46 83.82,50.01 79.38,50.01 74.3,44.93 v66.67,44.93
  Bottom 0.254: v65.41,41.76 66.04,42.39 66.04,44.3 v66.67,44.93 68.58,46.84 68.58,57.32 70.48,59.22 70.48,65.89 67.31,69.06 IC2.23 | IC1.23 38.1,69.06 40.64,66.52 40.64,44.3 v36.83,40.49
  Bottom 0.305: IC3.23 99.06,65.89 99.06,60.17 95.89,57 v95.89,55.73
N$1
  Top 0.305: IC4.4 136.84,62.39 134.62,64.61 IC5.5
N$2  (via drill 0.35)
  Top 0.254: IC9.4 104.78,13.82 103.12,15.47 103.06,15.53 103.03,15.53 103.03,28.9 102.42,29.5 v102.42,30.33 | v107.95,30.33 IC10.4
  Bottom 0.254: v102.42,30.33 v107.95,30.33
N$3
  Top 0.254: IC9.7 107.31,10.01 108.27,9.05 109.22,9.05 109.54,9.37 109.54,11.6 109.22,11.91 109.22,15.72 108.14,16.8 108.14,21.37 108.58,21.82 108.58,23.98 107.95,24.61 107.95,28.74 107.63,29.06 IC10.5
N$4  (via drill 0.35)
  Top 0.254: IC9.9 113.03,8.74 113.03,8.1 113.67,7.47 115.25,7.47 116.01,8.23 116.01,13.31 116.52,13.82 116.52,19.22 118.43,21.12 119.7,21.12 121.41,22.83 v121.41,29.06 | v113.98,28.42 113.35,29.06 IC10.12
  Bottom 0.254: v121.41,29.06 114.62,29.06 v113.98,28.42
N$5  (via drill 0.35)
  Top 0.254: v114.3,30.33 IC10.13 | v119.95,30.96 120.02,30.9 120.02,23.34 119.03,22.36 117.76,22.36 115.25,19.85 115.25,16.67 114.94,16.36 114.94,13.31 114.17,12.55 IC9.12
  Bottom 0.305: v119.95,30.96 119.32,30.33 v114.3,30.33
OPIF0  (via drill 0.35)
  Top 0.254: CON1.35 13.97,61.44 17.14,58.27 24.77,58.27 26.67,56.36 v36.83,56.36
  Bottom 0.254: v36.83,56.36 IC1.21
OPIF1  (via drill 0.35)
  Top 0.254: CON1.37 13.97,63.98 18.41,59.54 26.04,59.54 27.94,57.63 v50.16,57.63
  Bottom 0.254: IC2.13 50.16,63.35 v50.16,57.63
OPIF2  (via drill 0.35)
  Top 0.254: CON1.39 13.97,66.52 19.68,60.81 27.3,60.81 29.21,58.9 v52.07,58.9
  Bottom 0.254: IC2.14 53.34,61.44 53.34,60.17 v52.07,58.9
OPIF3  (via drill 0.35)
  Top 0.203: v51.69,60.81 51.24,60.36
  Top 0.254: CON1.40 11.43,67.79 13.97,67.79 20.32,61.44 27.94,61.44 29.84,59.54 50.42,59.54 v51.69,60.81
  Bottom 0.203: 53.98,64.62 IC2.15
  Bottom 0.254: v51.69,60.81 51.69,62.33 53.98,64.62
RUNIT0  (via drill 0.35)
  Top 0.254: CON1.21 v20.95,43.66
  Bottom 0.254: IC1.13 20.95,63.35 v20.95,43.66
RUNIT1  (via drill 0.35)
  Top 0.254: CON1.23 v22.23,46.2
  Bottom 0.254: IC1.14 22.23,59.54 v22.23,46.2
RUNIT2  (via drill 0.3)
  Top 0.254: CON1.25 v21.59,48.74
  Bottom 0.203: 24.77,64.62 IC1.15
  Bottom 0.254: v21.59,48.74 21.59,61.44 24.77,64.62
RUNIT3  (via drill 0.3)
  Top 0.254: CON1.27 v22.86,51.28
  Bottom 0.203: 27.94,62.71 27.94,65.25 IC1.17
  Bottom 0.254: 27.62,62.4 22.86,57.63 v22.86,51.28
  Bottom 0.305: 27.62,62.4 27.94,62.71
UCB0  (via drill 0.35)
  Top 0.254: v82.55,87.95 v99.69,87.95 | v31.59,87.95 v39.85,87.95 | IC10.2 104.78,32.87 103.76,33.88 v103.76,52.87 | v16.19,88.75 28.26,88.75 v29.05,87.95 | v52.23,87.95 v70.01,87.95 | v70.01,87.95
  Top 0.305: v29.05,87.95 v31.59,87.95
  Bottom 0.203: IC2.3 57.15,77.95 57.15,80.17 | IC3.3 87,77.95 87,79.86 | IC1.3 30.48,77.95 30.48,79.86 31.43,80.81
  Bottom 0.254: v52.23,87.95 53.34,86.84 53.34,84.3 57.15,80.49 57.15,80.17 | 87,79.86 87,80.49 83.82,83.67 83.82,86.68 v82.55,87.95 | v29.05,87.95 28.57,87.48 SJ1.2 | v99.69,87.95 99.69,78.59 | 31.43,80.81 32.07,81.45 32.07,87.48 v31.59,87.95 | IC14.2 8.89,92.56 12.7,88.75 v16.19,88.75 | v39.85,87.95 v52.23,87.95 | v52.23,87.95 | v70.01,87.95 v82.55,87.95 | v82.55,87.95
  Bottom 0.305: 99.69,78.59 103.5,74.78 103.5,54.46 103.76,54.2 v103.76,52.87
UCB1  (via drill 0.35)
  Top 0.254: v38.58,89.38 v30.48,89.38 29.53,90.34 v16.83,90.34 | v50.16,89.38 v55.24,89.38 v69.22,89.38 | v80.01,89.38 v85.72,89.38 v97.16,89.38 | v102.23,53.82 102.23,50.97 102.55,50.65 102.55,32.23 104.52,30.26 104.52,27.03 105.03,26.52 IC10.7
  Bottom 0.254: IC2.2 58.42,81.13 55.88,83.67 55.88,88.75 v55.24,89.38 | IC3.2 88.27,81.13 86.36,83.03 86.36,88.75 v85.72,89.38 | v38.58,89.38 v50.16,89.38 | v69.22,89.38 v80.01,89.38 | v97.16,89.38 97.16,78.59 | 29.84,90.02 SJ2.2 | 29.21,79.86 31.11,81.76 31.11,86.84 30.48,87.48 v30.48,89.38 | IC14.3 10.16,92.56 12.38,90.34 v16.83,90.34
  Bottom 0.305: 97.16,78.59 102.87,72.87 102.87,54.46 v102.23,53.82 | v30.48,89.38 29.84,90.02 | 29.21,79.86 IC1.2
UCB2  (via drill 0.35)
  Top 0.254: v112.08,90.65 110.49,92.24 v93.98,92.24 v80.01,92.24 | v50.16,92.24 v64.14,92.24 v69.22,92.24 | v38.58,92.24 v34.61,92.24 30.48,92.24 30,91.76 v19.21,91.76 | v112.08,79.54 112.08,51.28 115.57,47.79 115.57,30.33 114.94,29.69 114.94,27.79 113.67,26.52 IC10.10
  Bottom 0.254: v34.61,92.24 35.56,91.29 35.56,80.49 IC1.30 | 64.77,91.61 64.77,80.49 IC2.30 | v93.98,92.24 94.61,91.61 94.61,80.49 | 31.75,95.1 SJ3.2 | v69.22,92.24 v80.01,92.24 | v38.58,92.24 v50.16,92.24 | v112.08,90.65 v112.08,79.54 | IC14.4 11.43,92.56 12.7,91.29 18.73,91.29 18.89,91.45 v19.21,91.76
  Bottom 0.305: v64.14,92.24 64.77,91.61 | 94.61,80.49 IC3.30 | v34.61,92.24 31.75,95.1
UCB3  (via drill 0.35)
  Top 0.254: v111.12,89.38 109.7,90.81 v91.44,90.81 v80.8,90.81 | v51.44,90.81 v61.59,90.81 v70.01,90.81 | v111.12,78.59 111.12,50.65 114.62,47.15 114.62,33.19 114.3,32.87 IC10.15 | v17.46,92.24 18.41,93.19 v28.89,93.19 | v32.54,90.81 v39.85,90.81 | v39.85,90.81
  Bottom 0.203: 33.02,80.49 33.02,77.95 IC1.1 | 62.23,80.49 62.23,77.95 IC2.1 | 92.08,80.49 92.08,77.95 IC3.1
  Bottom 0.254: 62.23,80.49 62.23,90.18 v61.59,90.81 | 92.08,80.49 92.08,90.18 v91.44,90.81 | SJ4.2 28.26,92.56 v28.89,93.19 30.16,93.19 v32.54,90.81 | 33.02,90.34 33.02,80.49 | v70.01,90.81 v80.8,90.81 | v111.12,89.38 v111.12,78.59 | IC14.5 12.7,92.56 13.02,92.24 v17.46,92.24 | v39.85,90.81 v51.44,90.81 | v51.44,90.81
  Bottom 0.305: v32.54,90.81 33.02,90.34
UCBA0  (via drill 0.35)
  Top 0.254: IC6.2 v95.25,16.36 | v104.14,16.36 IC9.2
  Bottom 0.254: v95.25,16.36 v104.14,16.36
UCBA1  (via drill 0.35)
  Top 0.254: IC6.7 v95.25,10.01 | v104.14,10.01 104.14,11.91 104.78,12.55 IC9.5
  Bottom 0.254: v95.25,10.01 v104.14,10.01
UCBA2  (via drill 0.35)
  Top 0.254: IC6.10 100.97,10.01 101.6,9.37 v101.6,8.1 | v110.49,8.1 110.49,10.64 111.12,11.28 IC9.11
  Bottom 0.254: v101.6,8.1 104.14,8.1 104.78,8.74 106.68,8.74 107.31,8.1 v110.49,8.1
UCBA3  (via drill 0.35)
  Top 0.254: IC6.15 100.97,16.36 101.6,15.72 v101.6,15.09 | v110.17,16.04 111.12,15.09 IC9.14
  Bottom 0.254: v101.6,15.09 105.41,15.09 106.36,16.04 v110.17,16.04
UCBB0  (via drill 0.35)
  Top 0.254: IC9.3 v107.95,15.09 | v120.97,15.72 120.33,16.36 IC7.2
  Bottom 0.254: v107.95,15.09 111.12,15.09 111.76,15.72 v120.97,15.72
UCBB1  (via drill 0.35)
  Top 0.254: IC9.6 107.95,11.28 108.58,10.64 v108.58,10.01 | v116.84,10.01 IC7.7
  Bottom 0.305: v108.58,10.01 v116.84,10.01
UCBB2  (via drill 0.35)
  Top 0.254: IC9.10 113.67,10.01 114.3,9.37 v114.3,8.48 | v123.19,10.01 IC7.10
  Bottom 0.254: v114.3,8.48 121.67,8.48 v123.19,10.01
UCBB3  (via drill 0.35)
  Top 0.254: IC7.15 127.32,16.36 128.27,15.4 v128.27,14.77 | IC9.13 v113.98,13.82
  Bottom 0.254: v113.98,13.82 124.14,13.82 125.09,12.87 127.32,12.87 128.27,13.82 v128.27,14.77
UPC0  (via drill 0.3, 0.35)
  Top 0.203: 81.92,67.79 84.45,67.79 IC3.12 | 23.5,67.79 25.4,67.79 IC1.12 | 52.7,67.79 54.61,67.79 IC2.12
  Top 0.254: CON1.1 v20.32,18.26 33.66,18.26 38.1,22.71 v49.53,22.71 67.63,22.71 v77.03,32.11
  Top 0.305: v20.95,65.89 22.86,67.79 23.5,67.79 | v50.16,64.62 50.16,65.89 52.07,67.79 52.7,67.79 | v80.01,64.62 80.01,65.89 81.92,67.79
  Bottom 0.254: v50.16,64.62 49.53,63.98 v49.53,22.71 | v80.01,64.62 79.38,63.98 79.38,36.04 77.79,34.45 77.79,32.87 v77.03,32.11 | v20.95,65.89 20.32,65.25 v20.32,18.26
UPC1  (via drill 0.3, 0.35)
  Top 0.254: v78.11,36.36 71.6,29.85 71.44,29.69 66.99,25.25 v48.9,25.25 36.83,25.25 32.38,20.8 v19.68,20.8 CON1.3
  Bottom 0.254: v78.11,36.36 78.74,37 78.74,64.62 IC3.11 | IC2.11 48.9,64.62 v48.9,25.25 | IC1.11 22.86,69.06 19.68,65.89 19.68,21.76 v19.68,20.8 | v19.68,20.8
UPC2  (via drill 0.3, 0.35)
  Top 0.203: 23.5,70.33 25.4,70.33 IC1.10 | 52.7,70.33 54.61,70.33 IC2.10 | 81.92,70.33 84.45,70.33 IC3.10
  Top 0.254: v76.52,36.36 75.25,35.09 73.66,35.09 66.36,27.79 v48.26,27.79 35.56,27.79 31.11,23.34 v19.05,23.34 CON1.5
  Top 0.305: v20.95,68.43 22.86,70.33 23.5,70.33 | v50.16,67.16 50.16,68.43 52.07,70.33 52.7,70.33 | v80.01,67.16 80.01,68.43 81.92,70.33
  Bottom 0.254: v19.05,23.34 19.05,66.52 v20.95,68.43 | v50.16,67.16 48.26,65.25 v48.26,27.79 | v76.52,36.36 78.11,37.95 78.11,65.25 v80.01,67.16
UPC3  (via drill 0.3, 0.35)
  Top 0.254: v76.83,38.58 74.61,36.36 73.34,36.36 70.48,33.5 68.58,33.5 65.41,30.33 v47.62,30.33 34.29,30.33 29.84,25.88 v17.78,25.88 CON1.7
  Bottom 0.254: IC1.9 22.23,71.6 18.41,67.79 18.41,26.52 v17.78,25.88 | IC2.9 47.62,65.89 v47.62,30.33 | v76.83,38.58 77.47,39.22 77.47,65.89 IC3.9
VCC  (via drill 0.35)
  Top 1.27: EXP.C3 EXP.B3 EXP.A3 157.48,84.3 | EXP.A32 EXP.B32 EXP.C32 157.48,10.64
  Bottom 0.406: IC11.15 137.74,66.52
  Bottom 0.61: IC11.16 136.53,64.25 C14.1 | 7.62,83.67 IC14.20 7.52,84.25 C13.1
  Bottom 1.27: C13.1 v5.71,82.72
  other vias: 137.73,63.73 137.73,43.47 137.6,21.88
  pour Bottom (isolate 0.305, rank 2, no thermals): 136.37,67.48 138.11,67.48 138.11,63.35 136.37,63.35
  pour Bottom (isolate 0.305, rank 2, no thermals): 136.37,25.57 138.05,25.57 138.05,21.44 136.37,21.44
  pour Bottom (isolate 0.305, rank 2, no thermals): 136.21,46.52 137.95,46.52 137.95,44.77 138.11,44.62 138.11,42.65 136.21,42.65
  pour Top (isolate 0.61): 100.65,37 100.65,33.82 99.06,33.82 99.06,37
  pour Top (isolate 0.61): 113.35,37 113.35,33.82 111.76,33.82 111.76,37
  pour Top (isolate 0.61): 126.68,79.54 129.86,79.54 129.86,77.95 126.68,77.95
  pour Top (isolate 0.61): 126.05,20.49 126.05,17.31 124.46,17.31 124.46,20.49
  pour Top (isolate 0.61): 100.65,20.8 100.65,17.31 99.06,17.31 99.06,20.8
  pour Top (isolate 0.61): 113.35,19.53 113.35,17.31 111.76,17.31 111.76,19.53
  pour Top (isolate 0.305, rank 6): 0,100.18 0,-0.15 160.66,-0.15 160.66,100.18
  pour Top (isolate 0.305, no thermals): 148.75,85.41 155.89,85.41 155.89,83.19 148.75,83.19
  pour Top (isolate 0.305, no thermals): 148.75,11.75 155.89,11.75 155.89,9.53 148.75,9.53
WUNIT0  (via drill 0.3)
  Top 0.254: CON1.29 21.59,53.82 22.86,52.55 v33.02,52.55
  Bottom 0.254: IC1.18 31.75,62.08 33.02,60.81 v33.02,52.55
WUNIT1  (via drill 0.35)
  Top 0.203: 33.02,62.71 33.02,65.25 IC1.19
  Top 0.254: CON1.31 13.97,56.36 14.61,55.73 22.23,55.73 24.13,53.82 v34.29,53.82
  Top 0.305: v34.29,61.44 33.02,62.71
  Bottom 0.254: v34.29,53.82 v34.29,61.44
WUNIT2  (via drill 0.35)
  Top 0.254: CON1.33 13.97,58.9 15.88,57 23.5,57 25.4,55.09 v35.56,55.09
  Bottom 0.254: IC1.20 35.56,62.71 v35.56,55.09

## Text on the board
tNames: CFT Minicomputer Microcode Board rev A | PBU | (c) 2013 AlexiosC | (c) 2013 AlexiosC | http://www.bedroomlan.org/cft | To PBA | microcode-00 | microcode-01 | microcode-02 | Use Microcode v4+ ROM images | 00 | 01 | 02 | IC4-10: Optional (µCB Extension) | Bridge SJ1-4 if NOT installed. | UCB3 | UCB2 | UCB1 | UCB0 | Front Panel UCB LEDs
bNames: Bridge SJ1-4 if µCB Extension NOT installed. | http://www.bedroomlan.org/cft | PBU | To Processor Board A | (c) 2013 AlexiosC | CFT Minicomputer Microcode Board rev A | CFT